# Altium schematic sheet ExpansionBoard.SchDoc
size A4; SheetNumber: 6; SheetTotal: 7
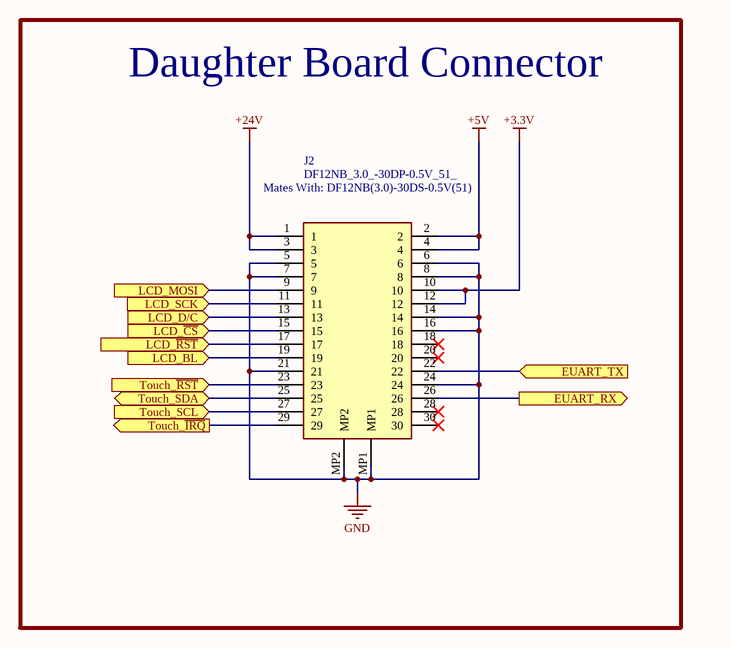
[diagram p0: ExpansionBoard.SchDoc]

## Parts
J2  DF12NB_3.0_-30DP-0.5V_51_  [DF12NB3030DP05V51]

## Blocks framed on the sheet
Daughter Board Connector: J2

## Ports
EUART_RX (out), EUART_TX (in), LCD_BL (in), LCD_D/C (in), LCD_MOSI (in), LCD_SCK (in), LCD_~{CS} (in), LCD_~{RST} (in), Touch_SCL (in), Touch_SDA (bidir), Touch_~{IRQ} (out), Touch_~{RST} (in)

## Nets
+3.3V: J2.10 J2.12
+5V: J2.2 J2.4
+24V: J2.1 J2.3
GND: J2.5 J2.6 J2.7 J2.8 J2.14 J2.16 J2.21 J2.24 J2.MP1 J2.MP2
EUART_RX: J2.26 ; port EUART_RX
EUART_TX: J2.22 ; port EUART_TX
LCD_BL: J2.19 ; port LCD_BL
LCD_~{CS}: J2.15 ; port LCD_~{CS}
LCD_D/C: J2.13 ; port LCD_D/C
LCD_MOSI: J2.9 ; port LCD_MOSI
LCD_~{RST}: J2.17 ; port LCD_~{RST}
LCD_SCK: J2.11 ; port LCD_SCK
Touch_~{IRQ}: J2.29 ; port Touch_~{IRQ}
Touch_~{RST}: J2.23 ; port Touch_~{RST}
Touch_SCL: J2.27 ; port Touch_SCL
Touch_SDA: J2.25 ; port Touch_SDA

Not connected (* = marked no-connect by the designer): J2 18* 20* 28* 30*

## Notes on the sheet
- (near J2) Mates With: DF12NB(3.0)-30DS-0.5V(51)

## Library data of the parts
J2 = DF12NB_3.0_-30DP-0.5V_51_: Connector; Manufacturer_Name: Hirose; Manufacturer_Part_Number: DF12NB(3.0)-30DP-0.5V(51); Datasheet Link: https://www.hirose.com/en/product/document?clcode=CL0537-0389-0-51&productname=DF12NB(3.0)-30DP-0.5V(51)&series=DF12N&documenttype=2DDrawing&lang=en&documentid=0001367354; Height: 2.5mm; Mouser Part Number: 798-DF12NB3030DP0551; Mouser Price/Stock: https://www.mouser.co.uk/ProductDetail/Hirose-Connector/DF12NB3.0-30DP-0.5V51?qs=DPoM0jnrROVGT6JTbeYOKw%3D%3D